# EAGLE design main (EAGLE 9.6.2)
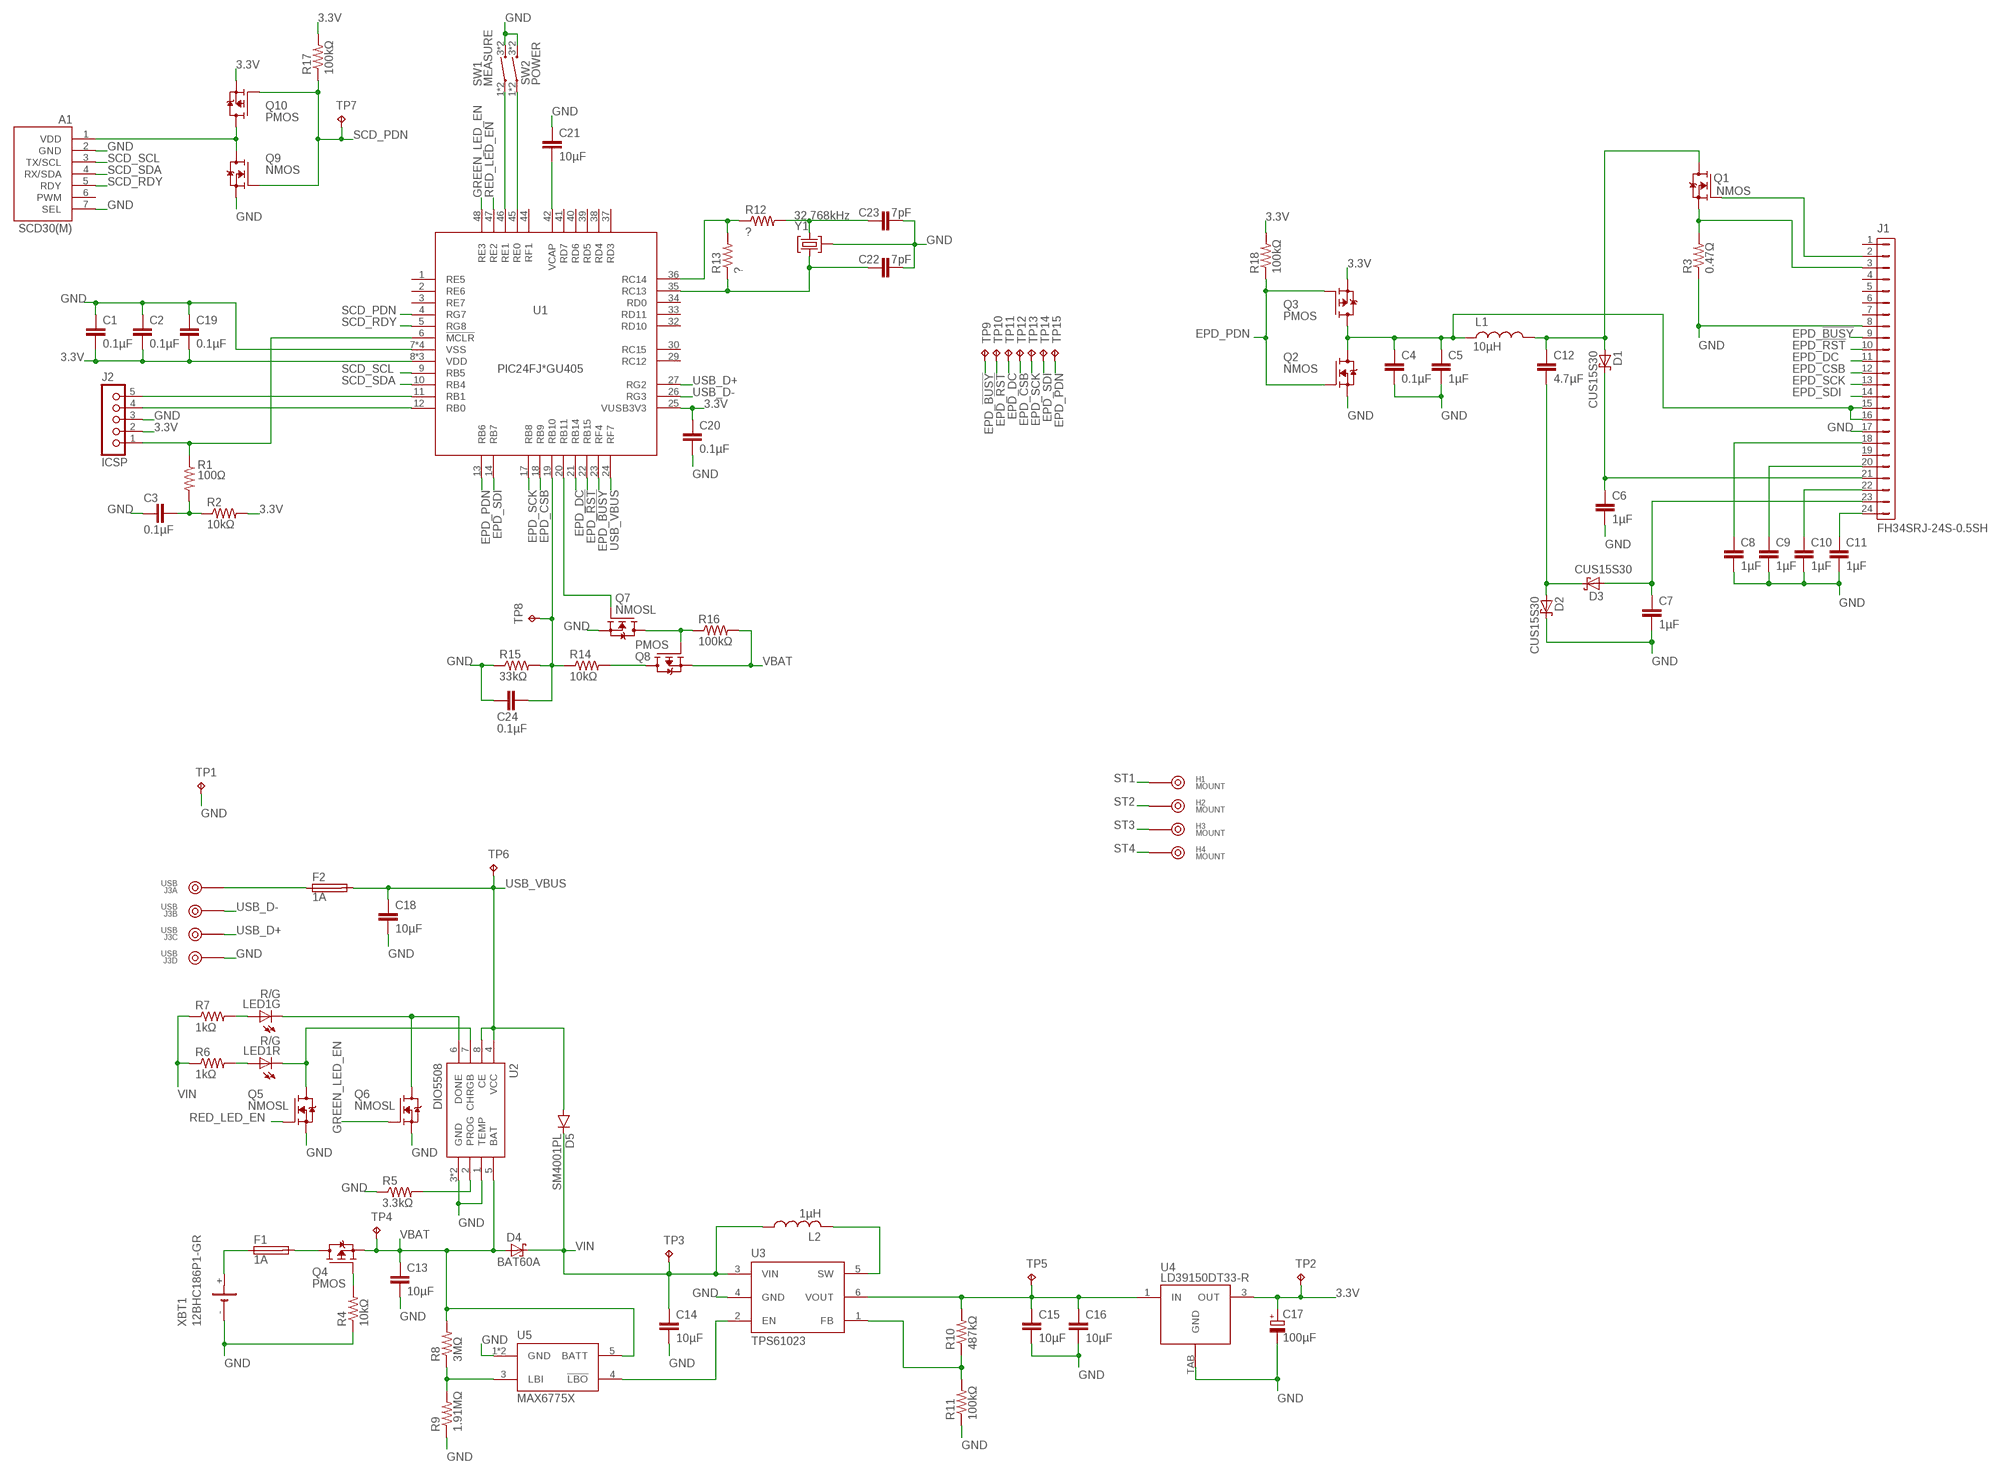
[diagram p0: schematic, sheet 1]

## Parts
A1  SCD30(M)  [SCD30-MIRRORED]
C1  0.1µF  C-EUC0603  [C0603]
C2  0.1µF  C-EUC0603  [C0603]
C3  0.1µF  C-EUC0603  [C0603]
C4  0.1µF  C-EUC0603  [C0603]
C5  1µF  C-EUC0603  [C0603]
C6  1µF  C-EUC0603  [C0603]
C7  1µF  C-EUC0603  [C0603]
C8  1µF  C-EUC0603  [C0603]
C9  1µF  C-EUC0603  [C0603]
C10  1µF  C-EUC0603  [C0603]
C11  1µF  C-EUC0603  [C0603]
C12  4.7µF  C-EUC0805  [C0805]
C13  10µF  C-EUC0805  [C0805]
C14  10µF  C-EUC0805  [C0805]
C15  10µF  C-EUC0805  [C0805]
C16  10µF  C-EUC0805  [C0805]
C17  100µF  CPOL-EUD  [PANASONIC_D]
C18  10µF  C-EUC0805  [C0805]
C19  0.1µF  C-EUC0603  [C0603]
C20  0.1µF  C-EUC0603  [C0603]
C21  10µF  C-EUC0805  [C0805]
C22  7pF  C-EUC0603  [C0603]
C23  7pF  C-EUC0603  [C0603]
C24  0.1µF  C-EUC0603  [C0603]
D1  CUS15S30  SOD323-SCHOTTKY  [SOD323]
D2  CUS15S30  SOD323-SCHOTTKY  [SOD323]
D3  CUS15S30  SOD323-SCHOTTKY  [SOD323]
D4  BAT60A  SOD323-SCHOTTKY  [SOD323]
D5  SM4001PL  DIODE-SOD123  [SOD123]
F1  1A  0603-FUSE  [C0603]
F2  1A  0603-FUSE  [C0603]
H1  MOUNT  7466313R  [7466313R]
H2  MOUNT  7466313R  [7466313R]
H3  MOUNT  7466313R  [7466313R]
H4  MOUNT  7466313R  [7466313R]
J1  FH34SRJ-24S-0.5SH  [FH34SRJ-24S-0.5SH]
J2  ICSP  5PIN-1.27  [5PIN-1.27]
J3  USB  GEN-4PIN  [4PIN]
L1  10µH  L-USL3225M  [L3225M]
L2  1µH  TYS4030  [TYS4030]
LED1  R/G  APHBM2012LSURKZGKC  [0805-DUALLED]
Q1  NMOS  SOT23-N-MOSFET  [SOT23]
Q2  NMOS  SOT23-N-MOSFET  [SOT23]
Q3  PMOS  SOT23-P-MOSFET  [SOT23]
Q4  PMOS  SOT23-P-MOSFET  [SOT23]
Q5  NMOSL  SOT23-N-MOSFET  [SOT23]
Q6  NMOSL  SOT23-N-MOSFET  [SOT23]
Q7  NMOSL  SOT23-N-MOSFET  [SOT23]
Q8  PMOS  SOT23-P-MOSFET  [SOT23]
Q9  NMOS  SOT23-N-MOSFET  [SOT23]
Q10  PMOS  SOT23-P-MOSFET  [SOT23]
R1  100Ω  R-US_R0603  [R0603]
R2  10kΩ  R-US_R0603  [R0603]
R3  0.47Ω  R-US_R0603  [R0603]
R4  10kΩ  R-US_R0603  [R0603]
R5  3.3kΩ  R-US_R0603  [R0603]
R6  1kΩ  R-US_R0603  [R0603]
R7  1kΩ  R-US_R0603  [R0603]
R8  3MΩ  R-US_R0603  [R0603]
R9  1.91MΩ  R-US_R0603  [R0603]
R10  487kΩ  R-US_R0603  [R0603]
R11  100kΩ  R-US_R0603  [R0603]
R12  ?  R-US_R0603  [R0603]
R13  ?  R-US_R0603  [R0603]
R14  10kΩ  R-US_R0603  [R0603]
R15  33kΩ  R-US_R0603  [R0603]
R16  100kΩ  R-US_R0603  [R0603]
R17  100kΩ  R-US_R0603  [R0603]
R18  100kΩ  R-US_R0603  [R0603]
SW1  MEASURE  PTS647  [PTS647]
SW2  POWER  PTS647  [PTS647]
TP1  RCU-0(J)  [TP_0603_JOINED]
TP2  RCU-0(J)  [TP_0603_JOINED]
TP3  RCU-0(J)  [TP_0603_JOINED]
TP4  RCU-0(J)  [TP_0603_JOINED]
TP5  RCU-0(J)  [TP_0603_JOINED]
TP6  RCU-0(J)  [TP_0603_JOINED]
TP7  RCU-0(J)  [TP_0603_JOINED]
TP8  RCU-0(J)  [TP_0603_JOINED]
TP9  RCU-0(J)  [TP_0603_JOINED]
TP10  RCU-0(J)  [TP_0603_JOINED]
TP11  RCU-0(J)  [TP_0603_JOINED]
TP12  RCU-0(J)  [TP_0603_JOINED]
TP13  RCU-0(J)  [TP_0603_JOINED]
TP14  RCU-0(J)  [TP_0603_JOINED]
TP15  RCU-0(J)  [TP_0603_JOINED]
U1  PIC24FJ*GU405  [TQFP48]
U2  DIO5508  [SOIC8-EP]
U3  TPS61023  [SOT563]
U4  LD39150DT33-R  DPAK-LDO  [DPAK]
U5  MAX6775X  MAX6776X  [SC70-5]
XBT1  12BHC186P1-GR  [12BHC186P1-GR]
Y1  32.768kHz  MS1V-T1K  [MS1V-T1K]

## Nets
3.3V: C1.2 C2.2 C17.+ C19.2 C20.1 J2.2 Q3.2(S) Q10.2(S) R2.2 R17.2 R18.2 TP2.1(TP) U1.8(VDD) U1.15(VDD) U1.25(VUSB3V3) U1.28(VDD) U4.3(OUT)
!MCLR: J2.1 R1.1 U1.6(!MCLR)
!MCLR!_FILTER: C3.1 R1.2 R2.1
BAT_!LBO: U3.2(EN) U5.4(!LBO)
BAT_LBI: R8.1 R9.2 U5.3(LBI)
BAT_RPP_GATE: Q4.1(G) R4.2
BOOST_FB: R10.1 R11.2 U3.1(FB)
BOOST_SW: L2.2 U3.5(SW)
BOOST_VOUT: C15.1 C16.1 R10.2 TP5.1(TP) U3.6(VOUT) U4.1(IN)
CHG_LED_G: LED1.K2(G:C) Q6.3(D) U2.6(DONE)
CHG_LED_G_RES: LED1.A2(G:A) R7.2
CHG_LED_R: LED1.K1(R:C) Q5.3(D) U2.7(CHRGB)
CHG_LED_R_RES: LED1.A1(R:A) R6.2
CHG_PROG: R5.2 U2.2(PROG)
EPD_!BUSY: J1.9 TP9.1(TP) U1.23(RF4)
EPD_!RST: J1.10 TP10.1(TP) U1.22(RB15)
EPD_BOOST: C12.1 D1.2(A) L1.2 Q1.3(D)
EPD_BOOST_LOW: C12.2 D2.2(A) D3.1(C)
EPD_CS: J1.3 Q1.2(S) R3.2
EPD_CSB: J1.12 TP12.1(TP) U1.18(RB9)
EPD_DC: J1.11 TP11.1(TP) U1.21(RB14)
EPD_GDR: J1.2 Q1.1(G)
EPD_PDN: Q2.1(G) Q3.1(G) R18.1 TP15.1(TP) U1.13(RB6)
EPD_SCK: J1.13 TP13.1(TP) U1.17(RB8)
EPD_SDI: J1.14 TP14.1(TP) U1.14(RB7)
EPD_VCOM: C11.1 J1.24
EPD_VDD: C4.1 C5.1 J1.15 J1.16 L1.1 Q2.3(D) Q3.3(D)
EPD_VDDD: C8.1 J1.18
EPD_VDH: C9.1 J1.20
EPD_VDL: C10.1 J1.22
EPD_VGH: C6.1 D1.1(C) J1.21
EPD_VGL: C7.1 D3.2(A) J1.23
GND: A1.2(GND) A1.7(SEL) C1.1 C2.1 C3.2 C4.2 C5.2 C6.2 C7.2 C8.2 C9.2 C10.2 C11.2 C13.2 C14.2 C15.2 C16.2 C17.- C18.2 C19.1 C20.2 C21.1 C22.2 C23.2 C24.2 D2.1(C) J1.8 J1.17 J2.3 J3.4 Q2.2(S) Q5.2(S) Q6.2(S) Q7.2(S) Q9.2(S) R3.1 R4.1 R5.1 R9.1 R11.1 R15.1 SW1.3 SW1.4 SW2.3 SW2.4 TP1.1(TP) U1.7(VSS) U1.16(VSS) U1.31(VSS) U1.43(VSS) U2.1(TEMP) U2.3(GND) U2.EP(GND) U3.4(GND) U4.TAB(GND) U5.1(GND) U5.2(GND) XBT1.- Y1.GND
GREEN_LED_EN: Q6.1(G) U1.48(RE3)
ICSPCLK: J2.5 U1.11(RB1)
ICSPDAT: J2.4 U1.12(RB0)
MCU_MEASURESW: SW1.1 SW1.2 U1.46(RE1)
MCU_POWERSW: SW2.1 SW2.2 U1.45(RE0)
MCU_SOSCI: C22.1 R13.1 U1.35(RC13) Y1.2
MCU_SOSCO: R12.1 R13.2 U1.36(RC14)
MCU_SOSCO_R: C23.1 R12.2 Y1.1
MCU_VCAP: C21.2 U1.42(VCAP)
RED_LED_EN: Q5.1(G) U1.47(RE2)
SCD_PDN: Q9.1(G) Q10.1(G) R17.1 TP7.1(TP) U1.4(RG7)
SCD_RDY: A1.5(RDY) U1.5(RG8)
SCD_SCL: A1.3(TX/SCL) U1.9(RB5)
SCD_SDA: A1.4(RX/SDA) U1.10(RB4)
SCD_VDD: A1.1(VDD) Q9.3(D) Q10.3(D)
ST1: H1.H1 H1.H2 H1.P
ST2: H2.H1 H2.H2 H2.P
ST3: H3.H1 H3.H2 H3.P
ST4: H4.H1 H4.H2 H4.P
USB_D+: J3.3 U1.27(RG2)
USB_D-: J3.2 U1.26(RG3)
USB_VBUS: C18.1 D5.A F2.2 TP6.1(TP) U1.24(RF7) U2.4(VCC) U2.8(CE)
USB_VBUS_RAW: F2.1 J3.1
VBAT: C13.1 D4.2(A) Q4.2(S) Q8.2(S) R8.2 R16.2 TP4.1(TP) U2.5(BAT) U5.5(BATT)
VBAT_FUSED: F1.2 Q4.3(D)
VBAT_GATECTL: Q7.3(D) Q8.1(G) R16.1
VBAT_GATED: Q8.3(D) R14.2
VBAT_MEASURE: C24.1 R14.1 R15.2 TP8.1(TP) U1.19(RB10)
VBAT_MEASURE_EN: Q7.1(G) U1.20(RB11)
VBAT_RAW: F1.1 XBT1.+
VIN: C14.1 D4.1(C) D5.C L2.1 R6.1 R7.1 TP3.1(TP) U3.3(VIN)
Unconnected: A1.6(PWM) J1.1 J1.4 J1.5 J1.6 J1.7 J1.19 U1.1(RE5) U1.2(RE6) U1.3(RE7) U1.29(RC12) U1.30(RC15) U1.32(RD10) U1.33(RD11) U1.34(RD0) U1.37(RD3) U1.38(RD4) U1.39(RD5) U1.40(RD6) U1.41(RD7) U1.44(RF1)

## Library data of the parts
A1 = BW-Active:SCD30: CO2, temperature and humidity sensor module
C1-C16 C18-C24 = rcl:C-EU: CAPACITOR, European symbol; SPICEPREFIX: C
C17 = rcl:CPOL-EU: POLARIZED CAPACITOR, European symbol; SPICEPREFIX: C
D1-D3 = BW-Active:SOD323-SCHOTTKY
D4 = ExtraParts:SOD323-SCHOTTKY
D5 = diode:DIODE-: DIODE
F1 F2 = BW-PassiveMechanical:0603-FUSE
H1-H4 = BW-Connectors:7466313R: M4 screw terminal, right-angle
J1 = BW-Connectors:FH34SRJ-24S-0.5SH: 24 pin FFC connector
J2 = BW-Connectors:5PIN-1.27: 5 pin header with 1.27mm pitch
J3 = BW-Connectors:GEN-4PIN
L1 = rcl:L-US: INDUCTOR, American symbol; SPICEPREFIX: L
L2 = BW-PassiveMechanical:TYS4030: Low current SMD inductor
LED1 = BW-Active:APHBM2012LSURKZGKC: Red/Green dual chip LED
Q1 Q2 Q5-Q7 Q9 = BW-Active:SOT23-N-MOSFET
Q3 Q4 Q8 Q10 = BW-Active:SOT23-P-MOSFET
R1-R18 = resistor:R-US_: RESISTOR, American symbol
SW1 SW2 = BW-PassiveMechanical:PTS647: Tactile microswitch
TP1 = BW-PassiveMechanical:RCU-0: Solderable probe pad in 0603 form; TP_SIGNAL_NAME: GND
TP2 = BW-PassiveMechanical:RCU-0: Solderable probe pad in 0603 form; TP_SIGNAL_NAME: 3.3V
TP3 = BW-PassiveMechanical:RCU-0: Solderable probe pad in 0603 form; TP_SIGNAL_NAME: VIN
TP4 = BW-PassiveMechanical:RCU-0: Solderable probe pad in 0603 form; TP_SIGNAL_NAME: VBAT
TP5 = BW-PassiveMechanical:RCU-0: Solderable probe pad in 0603 form; TP_SIGNAL_NAME: VBOOST
TP6 = BW-PassiveMechanical:RCU-0: Solderable probe pad in 0603 form; TP_SIGNAL_NAME: USB_V
TP7 = BW-PassiveMechanical:RCU-0: Solderable probe pad in 0603 form; TP_SIGNAL_NAME: SCD_PDN
TP8 = BW-PassiveMechanical:RCU-0: Solderable probe pad in 0603 form; TP_SIGNAL_NAME: VBAT_M
TP9 = BW-PassiveMechanical:RCU-0: Solderable probe pad in 0603 form; TP_SIGNAL_NAME: EPD_!BUSY
TP10 = BW-PassiveMechanical:RCU-0: Solderable probe pad in 0603 form; TP_SIGNAL_NAME: EPD_!RST
TP11 = BW-PassiveMechanical:RCU-0: Solderable probe pad in 0603 form; TP_SIGNAL_NAME: EPD_DC
TP12 = BW-PassiveMechanical:RCU-0: Solderable probe pad in 0603 form; TP_SIGNAL_NAME: EPD_CSB
TP13 = BW-PassiveMechanical:RCU-0: Solderable probe pad in 0603 form; TP_SIGNAL_NAME: EPD_SCK
TP14 = BW-PassiveMechanical:RCU-0: Solderable probe pad in 0603 form; TP_SIGNAL_NAME: EPD_SDI
TP15 = BW-PassiveMechanical:RCU-0: Solderable probe pad in 0603 form; TP_SIGNAL_NAME: EPD_PDN
U1 = BW-Active:PIC24FJ*GU405: 16-bit 32MHz microcontroller with USB, 48-pin
U2 = BW-Active:DIO5508: Single cell Li-ion battery charger
U3 = BW-Active:TPS61023: Low voltage boost converter with pass-through
U4 = BW-Active:DPAK-LDO
U5 = BW-Active:MAX6776X: Single cell battery undervoltage protector
XBT1 = BW-Connectors:12BHC186P1-GR: Single 18650 battery holder
Y1 = BW-PassiveMechanical:MS1V-T1K: 32.786kHz quartz with solderable body

## Board
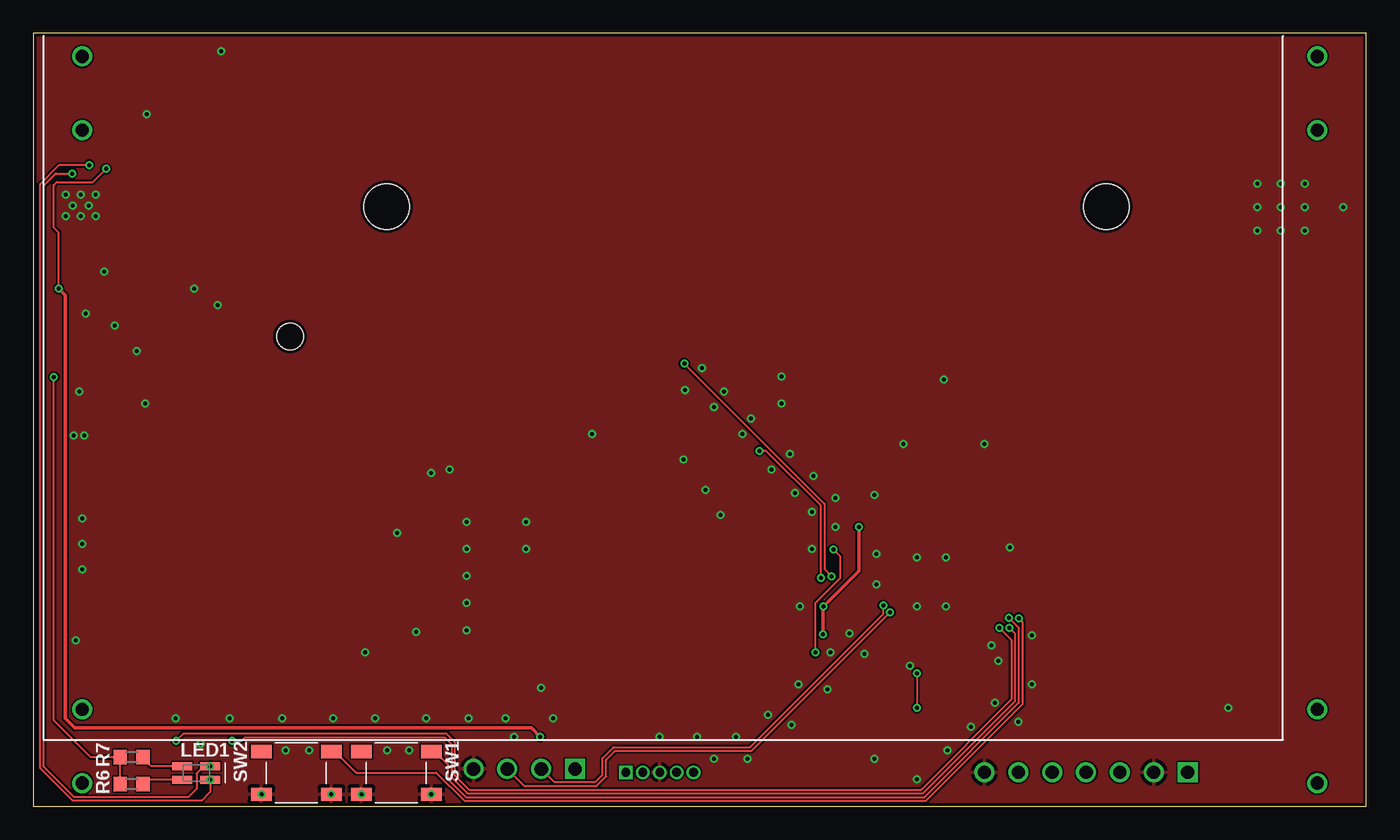
[diagram p1: board, top side]
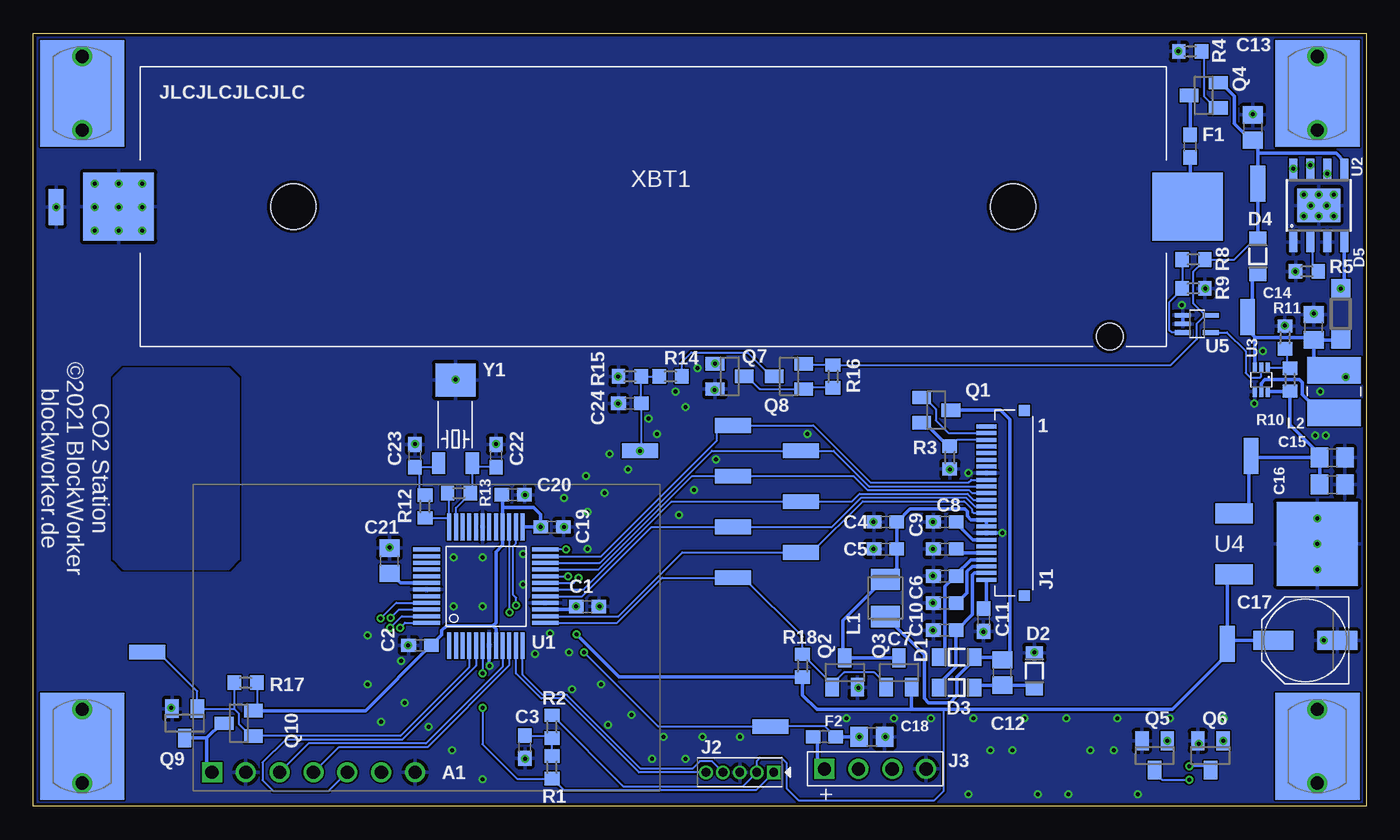
[diagram p2: board, bottom side, seen from below]

Size 100 x 58 mm. Coordinates in mm from the lower left corner, seen from the top.
Outline: 0,0 100,0 100,58 0,58 0,0
Copper layers (1*16): Top 0.035mm / dielectric 1.6mm / Bottom 0.035mm
Design rules "jlcpcb-2l": minimum track width 5mil, minimum drill 0.3mm, track to track 5mil, track to pad 5mil, pad to pad 5mil, via to via 5mil, smd to smd 0mil, copper to edge 0.25mm, drill to drill 6mil, minimum pad ring 0.15mm, minimum via ring 0.15mm, stop-mask expansion 4mil, vias tented up to drill 0.3mm, thermal gap 10mil

### Footprints (pad centres in the part's own frame; a part is rotated, then mirrored left to right if it is on the bottom)
SCD30-MIRRORED = drill 1 square: 1 0,0 | drill 1: 2 -2.54,0; 3 -5.08,0; 4 -7.62,0; 5 -10.16,0; 6 -12.7,0; 7 -15.24,0
C0603 = smd 1.1 x 1: 1 -0.85,0; 2 0.85,0
C0805 = smd 1.3 x 1.5: 1 -0.95,0; 2 0.95,0
PANASONIC_D = smd 3 x 1.4: + 2.4,0; - -2.4,0
SOD323 = smd 1 x 1.3: 1 -1.35,0; 2 1.35,0
SOD123 = smd 1.4 x 1.4: A 1.9,0; C -1.9,0
7466313R = drill 1: H1 -2.77,0; H2 2.77,0 | smd 8 x 6.33: P 0,0
FH34SRJ-24S-0.5SH = smd 0.3 x 1.5: 1 5.75,0.5; 2 5.25,0.5; 3 4.75,0.5; 4 4.25,0.5; 5 3.75,0.5; 6 3.25,0.5; 7 2.75,0.5; 8 2.25,0.5; 9 1.75,0.5; 10 1.25,0.5; 11 0.75,0.5; 12 0.25,0.5; 13 -0.25,0.5; 14 -0.75,0.5; 15 -1.25,0.5; 16 -1.75,0.5; 17 -2.25,0.5; 18 -2.75,0.5; 19 -3.25,0.5; 20 -3.75,0.5; 21 -4.25,0.5; 22 -4.75,0.5; 23 -5.25,0.5; 24 -5.75,0.5 | smd 0.8 x 0.8: C1 6.95,-2.35; C2 -6.95,-2.35
5PIN-1.27 = drill 0.65 pad 1.016 square: 1 -2.54,0 | drill 0.65 pad 1.016: 2 -1.27,0; 3 0,0; 4 1.27,0; 5 2.54,0
4PIN = drill 1 square: 1 -3.81,0 | drill 1: 2 -1.27,0; 3 1.27,0; 4 3.81,0
L3225M = smd 1.6 x 2.2: 1 -1.4,0; 2 1.4,0
TYS4030 = smd 2 x 4: 1 -1.6,0; 2 1.6,0
0805-DUALLED = smd 1.5 x 0.6: A1 1.05,0.5; A2 1.05,-0.5; K1 -1.05,0.5; K2 -1.05,-0.5
SOT23 = smd 1 x 1.4: 1 -0.95,-1.1; 2 0.95,-1.1; 3 0,1.1
R0603 = smd 1 x 1.1: 1 -0.85,0; 2 0.85,0
PTS647 = smd 1.55 x 1: 1 -2.625,1.6; 2 2.625,1.6; 3 -2.625,-1.6; 4 2.625,-1.6
TP_0603_JOINED = smd 2.7 x 1.1: 1 0,0
TQFP48 = smd 0.3 x 2: 1 -2.75,-4.45; 2 -2.25,-4.45; 3 -1.75,-4.45; 4 -1.25,-4.45; 5 -0.75,-4.45; 6 -0.25,-4.45; 7 0.25,-4.45; 8 0.75,-4.45; 9 1.25,-4.45; 10 1.75,-4.45; 11 2.25,-4.45; 12 2.75,-4.45; 25 2.75,4.45; 26 2.25,4.45; 27 1.75,4.45; 28 1.25,4.45; 29 0.75,4.45; 30 0.25,4.45; 31 -0.25,4.45; 32 -0.75,4.45; 33 -1.25,4.45; 34 -1.75,4.45; 35 -2.25,4.45; 36 -2.75,4.45 | smd 2 x 0.3: 13 4.45,-2.75; 14 4.45,-2.25; 15 4.45,-1.75; 16 4.45,-1.25; 17 4.45,-0.75; 18 4.45,-0.25; 19 4.45,0.25; 20 4.45,0.75; 21 4.45,1.25; 22 4.45,1.75; 23 4.45,2.25; 24 4.45,2.75; 37 -4.45,2.75; 38 -4.45,2.25; 39 -4.45,1.75; 40 -4.45,1.25; 41 -4.45,0.75; 42 -4.45,0.25; 43 -4.45,-0.25; 44 -4.45,-0.75; 45 -4.45,-1.25; 46 -4.45,-1.75; 47 -4.45,-2.25; 48 -4.45,-2.75
SOIC8-EP = smd 0.6 x 1.5: 1 -1.905,-2.75; 2 -0.635,-2.75; 3 0.635,-2.75; 4 1.905,-2.75; 5 1.905,2.75; 6 0.635,2.75; 7 -0.635,2.75; 8 -1.905,2.75 | smd 3.2 x 2.5: EP 0,0
SOT563 = smd 0.3 x 0.8: 1 -0.5,-0.9; 2 0,-0.9; 3 0.5,-0.9; 4 0.5,0.9; 5 0,0.9; 6 -0.5,0.9
DPAK = smd 1.5 x 2.8: 1 -2.286,-3.95; 3 2.286,-3.95 | smd 6.3 x 6.1: TAB 0,2.3
SC70-5 = smd 0.35 x 1.2: 1 -0.65,-1.05; 2 0,-1.05; 3 0.65,-1.05; 4 0.65,1.05; 5 -0.65,1.05
12BHC186P1-GR = smd 5.3 x 5.12: + -40.1,0; - 40.1,0 | hole 3.4: 27,0; -27,0 | hole 2: -34.25,9.75
MS1V-T1K = smd 1.6 x 1: 1 3.35,-1.27; 2 3.35,1.27 | smd 2.5 x 3: GND -2.9,0

### Placement (x,y rotation side)
A1  86.6,2.54 180 bottom
C1  58.42,14.99 180 bottom
C2  70.99,12.06 0 bottom
C3  63.12,4.45 270 bottom
C4  36.07,21.34 180 bottom
C5  36.07,19.3 180 bottom
C6  31.62,17.27 180 bottom
C7  31.62,13.21 180 bottom
C8  31.62,21.34 180 bottom
C9  31.62,19.3 180 bottom
C10  31.62,15.24 180 bottom
C11  28.7,13.97 270 bottom
C12  27.3,10.03 270 bottom
C13  8.51,50.93 90 bottom
C14  3.94,35.94 90 bottom
C15  2.54,26.16 0 bottom
C16  2.54,24.13 0 bottom
C17  4.57,12.45 180 bottom
C18  37.08,5.21 0 bottom
C19  61.09,20.95 180 bottom
C20  64.01,23.37 0 bottom
C21  73.28,18.41 270 bottom
C22  65.28,26.29 90 bottom
C23  71.37,26.29 90 bottom
C24  55.24,30.23 180 bottom
D1  30.73,11.18 0 bottom
D2  24.89,10.16 270 bottom
D3  30.73,8.89 180 bottom
D4  8.13,41.27 90 bottom
D5  1.91,36.96 90 bottom
F1  13.21,49.53 90 bottom
F2  40.64,5.21 0 bottom
H1  96.33,53.5 270 bottom
H2  3.67,53.5 90 bottom
H3  96.33,4.5 270 bottom
H4  3.67,4.5 90 bottom
J1  28,22.75 90 bottom
J2  46.99,2.54 180 bottom
J3  36.83,2.79 0 bottom
L1  36.07,15.62 270 bottom
L2  2.41,31.11 270 bottom
LED1  12.23,2.5 180 top
Q1  32.26,29.72 270 bottom
Q2  39.12,10.03 0 bottom
Q3  35.05,10.03 0 bottom
Q4  12.19,53.34 90 bottom
Q5  15.88,3.81 180 bottom
Q6  11.68,3.81 180 bottom
Q7  47.75,32.26 270 bottom
Q8  43.31,32.26 90 bottom
Q9  88.65,6.22 180 bottom
Q10  84.58,6.22 90 bottom
R1  61.09,2.92 90 bottom
R2  61.09,5.97 90 bottom
R3  31.24,26.16 90 bottom
R4  13.21,56.64 0 bottom
R5  4.45,40.13 0 bottom
R6  7.37,1.65 0 top
R7  7.37,3.68 0 top
R8  12.95,41.02 0 bottom
R9  12.95,38.86 180 bottom
R10  5.71,32 270 bottom
R11  6.1,35.18 270 bottom
R12  70.61,22.48 90 bottom
R13  68.07,23.5 180 bottom
R14  52.2,32.26 0 bottom
R15  55.24,32.26 0 bottom
R16  40.01,32.26 90 bottom
R17  84.07,9.27 0 bottom
R18  42.29,10.54 270 bottom
SW1  27.23,2.5 0 top
SW2  19.73,2.5 0 top
TP1  98.3,44.96 270 bottom
TP2  10.41,12.19 270 bottom
TP3  8.89,36.7 270 bottom
TP4  8.13,46.74 270 bottom
TP5  8.64,26.29 270 bottom
TP6  44.7,5.97 0 bottom
TP7  91.44,11.56 180 bottom
TP8  54.48,26.67 0 bottom
TP9  47.5,28.57 0 bottom
TP10  42.42,26.67 0 bottom
TP11  47.5,24.77 0 bottom
TP12  42.42,22.86 0 bottom
TP13  47.5,20.95 0 bottom
TP14  42.42,19.05 0 bottom
TP15  47.5,17.14 0 bottom
U1  66.04,16.51 0 bottom
U2  3.56,45.09 0 bottom
U3  7.87,32 180 bottom
U4  5.97,19.68 270 bottom
U5  12.7,36.2 270 bottom
XBT1  53.5,45 180 bottom
Y1  68.33,29.08 270 bottom

### Tracks (layer width: path | path; a pad name or v marks a point on that pad's centre or on a via)
3.3V  (via drill 0.3)
  Top 0.254: v59.26,12.9 59.26,14.97 C1.2 61.94,17.65 C19.2
  Bottom 0.152: U1.25 | R17.2 83.22,7.43 Q10.2 | 65.53,13.54 | R2.2 61.05,6.82 55.7,1.47 46.79,1.47 J2.2 45.72,3.4 45.49,3.63 43.87,3.63 43.48,3.25 43.48,1.35 42.6,0.46 32.38,0.46 31.7,1.14 31.7,7.26
  Bottom 0.254: 34.1,7.26 31.7,7.26 14.53,7.26 10.41,11.38 TP2.1 | 34.1,7.26 41.22,7.26 42.29,8.33 R18.2 56.05,9.69 v59.26,12.9 | Q3.2 34.1,7.26 | U4.3 10.41,16.9 TP2.1 | C17.+ 10.16,12.45 TP2.1 | U1.15 59.5,14.76 C1.2 | U1.25 C19.2 61.94,21.88 62.48,22.43 64.79,22.43 | 64.79,22.43 U1.28 64.79,19.59 65.3,19.08 65.3,13.77 65.53,13.54 65.29,13.3 U1.8 | 64.79,22.43 64.79,23.3 C20.1 | 65.53,13.54 69.01,13.54 69.36,13.19 69.36,12.85 C2.2 70.18,12.06 75.07,7.17 Q10.2
  other vias: 59.27,14.99 61.94,20.95
!MCLR  (via drill 0.3)
  Top 0.152: v66.29,9.98 v66.29,7.39
  Bottom 0.152: U1.6 v66.29,9.99 v66.29,9.98 | v66.29,7.39 66.29,4.65 63.72,2.07 R1.1 61.06,2.07 60.18,1.19 45.8,1.19 J2.1
!MCLR!_FILTER
  Bottom 0.152: R1.2 61.09,5.11 | 61.09,5.11 R2.1 | C3.1 61.28,5.29 61.09,5.11
BAT_!LBO
  Bottom 0.152: U5.4 10.45,35.55 9.04,34.14 9.04,32.51 8.71,32.18 7.95,32.18 7.87,32.26 U3.2
BAT_LBI
  Bottom 0.152: R8.1 R9.2 13.8,38.8 14.76,37.85 14.76,35.71 14.59,35.55 U5.3
BAT_RPP_GATE
  Bottom 0.152: R4.2 12.17,56.45 12.17,53.26 11.29,52.39 Q4.1
BOOST_FB
  Bottom 0.152: R11.2 5.97,34.2 5.97,33.11 R10.1 5.76,32.9 U3.1
BOOST_SW
  Bottom 0.254: L2.2 3.4,29.52 4.78,30.89 4.78,31.77 5,32 7.59,32 7.87,31.73 U3.5
BOOST_VOUT
  Bottom 0.254: C15.1 3.49,26.4 5.71,28.63 R10.2 5.76,31.1 U3.6 | C15.1 C16.1 | C15.1 8.51,26.16 TP5.1 8.81,26.11 8.81,22.48 9.32,21.97 U4.1
CHG_LED_G  (via drill 0.3)
  Top 0.152: LED1.K2 12.78,3 12.24,2.46 12.24,1.32 11.61,0.69 3.07,0.69 0.79,2.97 0.79,46.58 1.68,47.48 v2.92,47.48
  Bottom 0.152: Q6.3 11.97,3 LED1.K2 | U2.6 v2.92,47.48
  other vias: 13.28,3
CHG_LED_G_RES
  Top 0.152: LED1.A2 8.85,3 8.22,3.63 R7.2
CHG_LED_R  (via drill 0.3)
  Top 0.152: LED1.K1 13.28,1.06 12.62,0.41 2.96,0.41 0.51,2.86 0.51,46.7 1.92,48.11 v4.19,48.11
  Bottom 0.152: Q5.3 15.88,2.56 15.32,2 LED1.K1 | U2.7 v4.19,48.11
  other vias: 13.28,2
CHG_LED_R_RES
  Top 0.152: LED1.A1 8.56,2 R6.2
CHG_PROG
  Bottom 0.152: R5.2 3.99,40.52 3.99,42.13 U2.2
EPD_!BUSY
  Bottom 0.152: J1.9 29.63,24.5 29.84,24.28 37.18,24.28 41.48,28.57 TP9.1 48.23,28.57 48.72,28.09 48.72,27.44 57.4,18.76 U1.23
EPD_!RST
  Bottom 0.152: J1.10 37.3,24 39.97,26.67 TP10.1 49.09,26.67 57.5,18.26 U1.22
EPD_BOOST
  Bottom 0.254: L1.2 36.01,14.22 33.15,11.35 33.15,8.08 32.84,7.77 31.24,7.77 30.71,8.31 30.71,9.7 29.38,11.03 D1.2 27.5,11.18 C12.1 26.75,11.54 26.75,29.03 27.43,29.72 Q1.3
EPD_BOOST_LOW
  Bottom 0.254: D3.1 29.19,9.08 C12.2 25.16,9.08 D2.2
EPD_CS
  Bottom 0.152: J1.3 30.69,27.5 31.18,27.01 R3.2
  Bottom 0.254: Q1.2 33.11,28.77 31.36,27.01 R3.2
EPD_CSB
  Bottom 0.152: J1.12 29.47,23 29.92,23.44 38,23.44 38.59,22.86 TP12.1 52.11,22.86 58.71,16.26 U1.18
EPD_DC
  Bottom 0.152: J1.11 29.58,23.5 29.8,23.72 37.41,23.72 38.46,24.77 TP11.1 50.6,24.77 57.6,17.76 U1.21
EPD_GDR
  Bottom 0.152: Q1.1 33.16,30.67 32.28,29.79 32.28,28.96 31.33,28 J1.2
EPD_PDN
  Bottom 0.152: Q3.1 36,9.13 36.91,10.03 39.17,10.03 40.07,9.13 Q2.1 40.07,9.18 42.28,11.39 R18.1 42.29,12.72 46.71,17.14 47.47,17.14 TP15.1 52.82,17.14 56.2,13.76 U1.13
EPD_SCK
  Bottom 0.152: J1.13 29.37,22.5 30.03,23.16 37.89,23.16 40.09,20.95 47.42,20.95 TP13.1 53.62,20.95 58.81,15.76 U1.17
EPD_SDI
  Bottom 0.152: J1.14 29.44,22 29.56,22.12 29.56,22.3 30.15,22.89 37.77,22.89 41.6,19.05 TP14.1 51.31,19.05 56.1,14.26 U1.14
EPD_VCOM
  Bottom 0.254: J1.24 28.5,15.02 C11.1
EPD_VDD
  Bottom 0.254: Q3.3 Q2.3 39.24,11.26 39.24,13.95 36.17,17.02 L1.1 35.22,17.87 C5.1 C4.1 35.18,21.34 34.21,22.3 30.1,22.3 29.92,22.12 29.92,21.77 29.65,21.5 J1.15 J1.16
EPD_VDDD
  Bottom 0.254: J1.18 29.5,20 30.77,21.27 C8.1
EPD_VDH
  Bottom 0.254: C9.1 30.47,19 J1.20
EPD_VDL
  Bottom 0.254: C10.1 30.71,15.24 29.95,16 29.95,17.6 29.55,18 J1.22
EPD_VGH
  Bottom 0.254: D1.1 32.08,11.32 31.62,11.79 31.62,16.48 30.84,17.27 C6.1 30.77,17.39 29.66,18.5 J1.21
EPD_VGL
  Bottom 0.254: D3.2 32.08,9.14 30.77,10.45 C7.1 30.71,13.21 29.54,14.38 29.54,17.35 29.39,17.5 J1.23
GND  (via drill 0.3)
  Bottom 0.254: U5.1 U5.2 | J1.17 v27.31,20.5 v27.3,20.5 | U1.7 v65.79,10.54
  other vias: 4.7,45.9 3.56,45.9 2.41,45.9 4.7,44.27 3.56,44.27 2.41,44.27 4.14,45.09 2.97,45.09 3.05,27.81 3.81,27.81 3.68,19.68 3.68,21.59 3.68,17.78 3.17,12.45 3.94,36.96 8.38,30.23 14.1,56.64 8.51,51.94 5.33,40.13 6.1,36.07 12.06,38.86 13.84,37.59 12.57,4.7 18.92,4.19 17.14,0.89 22.35,0.89 24.64,0.89 29.84,0.89 29.46,6.6 25.65,6.6 22.48,6.6 18.67,6.6 14.73,6.6 28.19,4.19 26.54,4.19 20.7,4.19 10.67,6.6 32.64,6.6 35.43,6.6 36.07,5.21 38.99,6.6 24.89,11.56 46.99,5.21 49.78,5.21 52.7,5.21 55.12,6.86 57.4,9.14 59.82,11.56 51.05,3.56 53.59,3.56 56.9,6.1 59.56,8.76 62.36,11.43 61.21,12.95 28.7,13.08 32.51,13.21 32.51,15.24 32.51,17.27 32.51,19.3 32.51,21.34 36.96,21.34 36.96,19.3 31.24,25.27 38.1,8.89 29.84,25.02 56.13,32.26 56.13,30.23 57.53,14.99 63.25,18.92 63.25,16.64 60.2,20.95 58.42,19.3 58.42,22.1 57.15,23.5 55.37,25.27 53.21,27.94 51.05,29.97 48.9,31.24 50.16,32.89 51.82,31.11 53.85,29.08 56.77,26.42 58.55,24.77 60.2,23.11 63.12,23.37 65.28,27.18 68.33,32 71.37,27.18 73.28,19.43 66.29,18.67 66.29,14.99 68.45,14.99 68.45,18.67 71.88,12.06 72.39,10.92 72.14,7.75 70.36,5.97 68.58,4.19 66.29,2.03 73.91,6.35 74.93,9.14 74.93,12.83 89.66,7.37 95.38,46.74 93.6,46.74 91.82,46.74 91.82,43.18 93.6,43.18 95.38,43.18 95.38,44.96 93.6,44.96 91.82,44.96 98.3,44.96 63.12,3.56 51.56,21.84 50.42,23.75 41.91,27.94 48.77,26.04 3.43,31.11 7.75,34.16
  pour Top (rank 6): -1.27,58.42 0,59.69 100.33,59.69 101.6,58.42 101.6,0 100.33,-1.27 0,-1.27 -1.27,0
  pour Bottom (rank 6): -1.27,58.42 0,59.69 100.33,59.69 101.6,58.42 101.6,0 100.33,-1.27 0,-1.27 -1.27,0
GREEN_LED_EN  (via drill 0.3)
  Top 0.152: Q6.1 11.26,5.44 30.99,5.44 31.65,4.78 31.65,2.29 32.69,1.25 66.62,1.25 73.38,8 73.38,12.5 v72.49,13.39
  Bottom 0.152: v72.49,13.39 72.12,13.76 U1.48
  other vias: 10.73,4.91
ICSPCLK
  Bottom 0.152: J2.5 54.56,2.54 60.1,8.08 61.9,8.08 63.79,9.97 U1.11
ICSPDAT
  Bottom 0.152: J2.4 49.1,3.38 49.99,3.38 50.55,2.82 54.44,2.82 59.98,8.36 61.78,8.36 63.29,9.86 U1.12
LOGO
  pour Bottom: 93.98,32.13 93.22,32.89 85.34,32.89 84.58,32.13 84.58,18.54 85.34,17.78 93.22,17.78 93.98,18.54
MCU_MEASURESW  (via drill 0.3)
  Top 0.152: SW1.2 30.14,4.1 31.09,3.15 31.09,2.06 32.46,0.69 66.86,0.69 73.96,7.79 73.96,13.37 v73.2,14.12
  Bottom 0.152: v73.2,14.12 72.57,14.76 U1.46
MCU_POWERSW  (via drill 0.3)
  Top 0.152: SW2.2 22.65,4.1 24.23,2.52 30.23,2.52 32.34,0.41 66.97,0.41 74.24,7.67 74.24,13.8 v73.93,14.11
  Bottom 0.152: v73.93,14.11 72.78,15.26 U1.45
MCU_SOSCI
  Bottom 0.152: U1.35 68.29,22.39 67.22,23.46 R13.1 67.06,23.66 Y1.2 66.76,25.44 C22.1
MCU_SOSCO
  Bottom 0.152: U1.36 68.79,21.61 | 68.79,21.61 68.79,23.36 R13.2 | R12.1 68.8,21.63 68.79,21.61
MCU_SOSCO_R
  Bottom 0.152: R12.2 71.02,23.73 71.02,25.08 C23.1 69.89,25.44 Y1.1
MCU_VCAP
  Bottom 0.254: U1.42 72.46,16.76 73.17,17.46 C21.2
RED_LED_EN  (via drill 0.3)
  Top 0.152: Q5.1 15.63,4.91 15.88,5.16 30.87,5.16 31.37,4.66 31.37,2.17 32.57,0.96 66.74,0.96 73.68,7.91 73.68,12.93 v73.22,13.4
  Bottom 0.152: v73.22,13.4 72.35,14.26 U1.47
  other vias: 14.93,4.91
SCD_PDN
  Bottom 0.152: 84.94,7.32 Q9.1 87.7,8.63 90.63,11.56 TP7.1 | 84.94,7.32 84.58,6.96 84.58,6.17 83.68,5.27 Q10.1 72.45,5.27 67.29,10.43 U1.4 | R17.1 84.94,9.25 84.94,7.32
SCD_RDY
  Bottom 0.152: U1.5 66.79,10.54 72.33,4.99 81.09,4.99 82.8,3.28 82.8,1.96 81.99,1.14 77.84,1.14 A1.5
SCD_SCL
  Bottom 0.152: U1.9 64.79,10.47 70.55,4.71 79.35,4.71 A1.3
SCD_SDA
  Bottom 0.152: U1.10 64.29,10.57 70.43,4.43 77.08,4.43 A1.4
SCD_VDD
  Bottom 0.254: Q9.3 86.98,5.12 | Q10.3 85.88,6.22 86.98,5.12 | A1.1 86.98,2.92 86.98,5.12
USB_D+  (via drill 0.3)
  Top 0.152: J3.3 36.83,1.52 42.27,1.52 42.98,2.23 42.98,3.48 43.64,4.14 53.87,4.14 v64.29,14.55
  Bottom 0.152: v64.29,14.55 U1.27
USB_D-  (via drill 0.3)
  Top 0.152: v63.77,15.07 63.77,14.44 53.76,4.42 43.52,4.42 42.7,3.6 42.7,2.35 42.15,1.8 39.09,1.8 J3.2
  Bottom 0.152: v63.77,15.07 63.77,15.64 64.01,15.88 64.01,19.51 63.79,19.73 U1.26
USB_VBUS  (via drill 0.3)
  Top 0.152: D5.A 1.91,43.05 1.52,43.43 1.52,46.61 1.75,46.84 4.46,46.84 U2.8 | v58.67,11.53 58.67,15.24 60.55,17.12 60.55,18.73 v60.02,19.26
  Top 0.254: C18.1 37.37,5.87 3.1,5.87 2.39,6.58 2.39,38.37 D5.A
  Bottom 0.152: F2.2 39.83,5.21 40.64,6.02 44.65,6.02 TP6.1 53.11,5.97 v58.67,11.53 | v60.02,19.26 U1.24
  Bottom 0.254: D5.A 1.65,39.11 U2.4 | F2.2 C18.1
  other vias: 1.91,38.86 5.46,47.84 38.03,5.21
USB_VBUS_RAW
  Bottom 0.254: J3.1 41.17,3.33 41.17,4.89 F2.1
VBAT
  Bottom 0.152: D4.2 8.28,42.62 9.88,41.02 R8.2 12.1,40.96 12.95,40.11 12.95,37.72 12.08,36.84 | U5.5 12.08,36.84 | Q8.2 42.11,33.11 R16.2 14.64,33.11 12.7,35.05 12.7,36.23 12.08,36.84
  Bottom 0.254: Q4.2 10.91,54.29 9.91,53.29 9.91,51.23 8.65,49.98 C13.1 8.13,49.6 8.13,49 | 8.13,49 TP4.1 D4.2 | U2.5 1.65,48.39 2.26,49 8.13,49
VBAT_FUSED
  Bottom 0.254: F1.2 13.21,53.26 Q4.3
VBAT_GATECTL
  Bottom 0.152: Q7.3 46.46,32.26 45.51,31.31 Q8.1 42.11,31.41 R16.1
VBAT_GATED
  Bottom 0.152: R14.2 51.35,33.34 50.62,34.06 46.41,34.06 44.6,32.26 Q8.3
VBAT_MEASURE  (via drill 0.3)
  Top 0.152: v59.08,17.12 59.08,22.55 54.97,26.67 TP8.1
  Bottom 0.152: U1.19 61.57,16.74 59.46,16.74 v59.08,17.12 | TP8.1 54.4,26.76 C24.1 R15.2 R14.1
  other vias: 54.48,26.67
VBAT_MEASURE_EN  (via drill 0.3)
  Top 0.152: v59.89,17.26 59.36,17.79 59.36,22.68 48.85,33.19 Q7.1
  Bottom 0.152: U1.20 v59.9,17.26 v59.89,17.26
  other vias: 48.85,33.21
VBAT_RAW
  Bottom 0.254: XBT1.+ 13.21,45.19 F1.1
VIN  (via drill 0.3)
  Top 0.152: R6.1 R7.1 4.31,3.68 1.55,6.44 v1.55,32.21
  Bottom 0.152: v1.55,32.21 2.06,32.72 L2.1
  Bottom 0.254: D5.C 1.97,34.99 C14.1 | C14.1 3.94,33.2 3.45,32.72 L2.1 | C14.1 4.12,35.18 8.33,35.18 | 8.33,35.18 8.89,35.74 TP3.1 8.56,37.03 8.56,39.49 D4.1 | 8.33,35.18 8.37,35.18 U3.3

### Text on the board
bPlace: JLCJLCJLCJLC | 1 | CO2 Station / ©2021 BlockWorker / blockworker.de | +